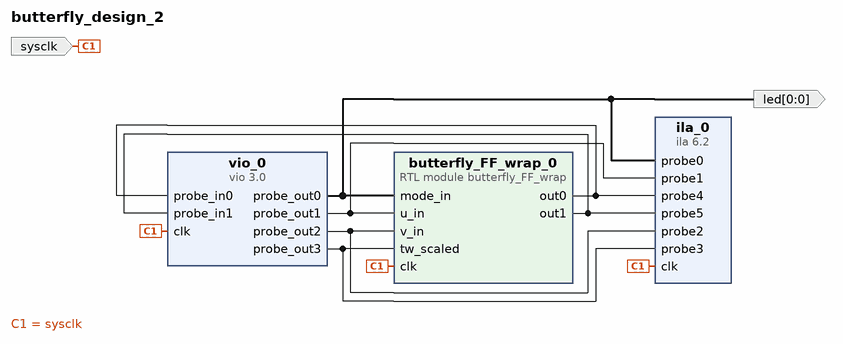
[diagram p0: block diagram of the top level]
# Vivado block design butterfly_design_2, xc7a35tcpg236-1, Vivado 2023.2
create_bd_design butterfly_design_2

create_bd_port -dir I -type clk sysclk
create_bd_port -dir O -from 0 -to 0 -type data led

create_bd_cell -type ip -vlnv xilinx.com:ip:vio:3.0 vio_0
set_property -dict [list \
  CONFIG.C_NUM_PROBE_IN 2 \
  CONFIG.C_NUM_PROBE_OUT 4 \
  CONFIG.C_PROBE_OUT1_WIDTH 12 \
  CONFIG.C_PROBE_OUT2_WIDTH 12 \
  CONFIG.C_PROBE_OUT3_WIDTH 12 \
] [get_bd_cells vio_0]
create_bd_cell -type ip -vlnv xilinx.com:ip:ila:6.2 ila_0
set_property -dict [list \
  CONFIG.C_MONITOR_TYPE Native \
  CONFIG.C_NUM_OF_PROBES 6 \
  CONFIG.C_PROBE1_WIDTH 12 \
  CONFIG.C_PROBE2_WIDTH 12 \
  CONFIG.C_PROBE3_WIDTH 12 \
  CONFIG.C_PROBE4_WIDTH 12 \
  CONFIG.C_PROBE5_WIDTH 12 \
] [get_bd_cells ila_0]
create_bd_cell -type module -reference butterfly_FF_wrap butterfly_FF_wrap_0

# ---- connections ----

connect_bd_net -net butterfly_k2red_kyber_0_out0 [get_bd_pins butterfly_FF_wrap_0/out0] [get_bd_pins vio_0/probe_in0] [get_bd_pins ila_0/probe4]
connect_bd_net -net butterfly_k2red_kyber_0_out1 [get_bd_pins butterfly_FF_wrap_0/out1] [get_bd_pins vio_0/probe_in1] [get_bd_pins ila_0/probe5]
connect_bd_net -net clk_0_1 [get_bd_ports sysclk] [get_bd_pins ila_0/clk] [get_bd_pins vio_0/clk] [get_bd_pins butterfly_FF_wrap_0/clk]
connect_bd_net [get_bd_pins vio_0/probe_out0] [get_bd_pins ila_0/probe0] [get_bd_ports led] [get_bd_pins butterfly_FF_wrap_0/mode_in]
connect_bd_net [get_bd_pins vio_0/probe_out1] [get_bd_pins ila_0/probe1] [get_bd_pins butterfly_FF_wrap_0/u_in]
connect_bd_net [get_bd_pins vio_0/probe_out2] [get_bd_pins ila_0/probe2] [get_bd_pins butterfly_FF_wrap_0/v_in]
connect_bd_net [get_bd_pins vio_0/probe_out3] [get_bd_pins ila_0/probe3] [get_bd_pins butterfly_FF_wrap_0/tw_scaled]

validate_bd_design
save_bd_design
